# Altium schematic sheet CO2_Metar_SCH_0.SchDoc
size A; DocumentNumber: 1; SheetNumber: 1; SheetTotal: 2
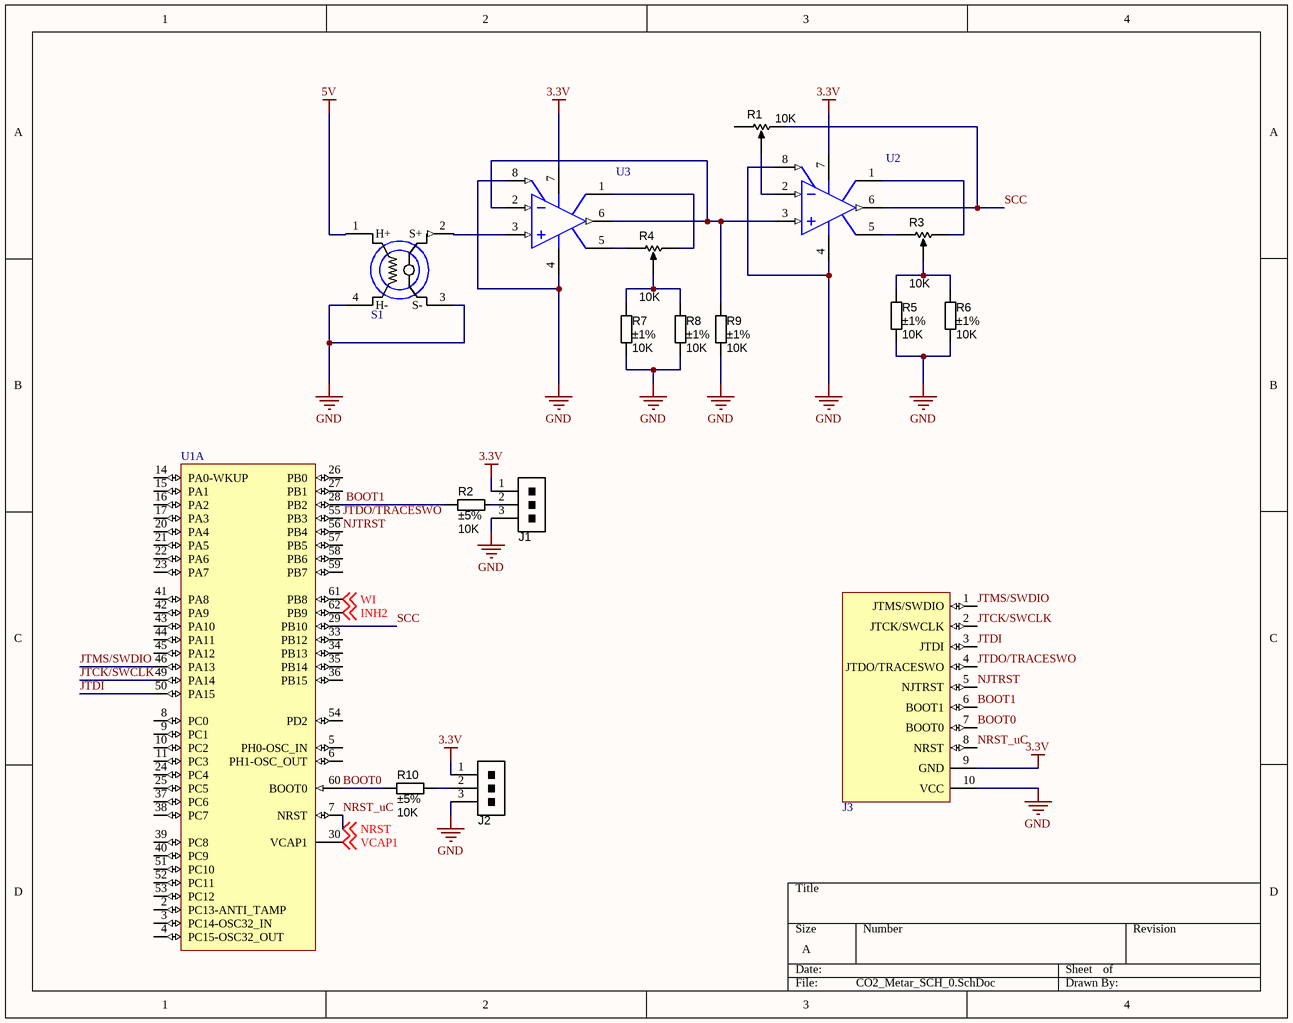
[diagram p0: CO2_Metar_SCH_0.SchDoc]

## Parts
J1  *  [1x3POS_HEADER]  (value not drawn)
J2  *  [1x3POS_HEADER]  (value not drawn)
J3  *  [SWJ-DP connector]  (value not drawn)
R1  value 10K  [TrimPot_SMD_Bourns_3214G]  (hidden comment: 5 Turn)
R2  value 10K  Tolerance: ±5%  [RESC1608X55N]  (hidden comment: Thick Film)
R3  value 10K  [TrimPot_SMD_Bourns_3214G]  (hidden comment: 5 Turn)
R4  value 10K  [TrimPot_SMD_Bourns_3214G]  (hidden comment: 5 Turn)
R5  value 10K  Tolerance: ±1%  [RESC1608X55N]  (hidden comment: Thick Film)
R6  value 10K  Tolerance: ±1%  [RESC1608X55N]  (hidden comment: Thick Film)
R7  value 10K  Tolerance: ±1%  [RESC1608X55N]  (hidden comment: Thick Film)
R8  value 10K  Tolerance: ±1%  [RESC1608X55N]  (hidden comment: Thick Film)
R9  value 10K  Tolerance: ±1%  [RESC1608X55N]  (hidden comment: Thick Film)
R10  value 10K  Tolerance: ±5%  [RESC1608X55N]  (hidden comment: Thick Film)
S1  *  [CO2_SENSOR]  (value not drawn)
U1  (no value)  [STM-LQFP64_N]  (part A of 2)
U2  (no value)  [D008_L]
U3  (no value)  [D008_L]

## Nets
3.3V: J1.1 J2.1 J3.9(GND) U2.7(V+) U3.7(V+)
5V: S1.1(H+)
GND: J1.3 J2.3 J3.10(VCC) R5.2 R6.2 R7.2 R8.2 R9.2 S1.3(S-) S1.4(H-) U2.4(V-) U2.8(BSEL) U3.4(V-) U3.8(BSEL)
BOOT0: J3.7(BOOT0) R10.2 U1.60(BOOT0)
BOOT1: J3.6(BOOT1) R2.2 U1.28(PB2)
INH2: U1.62(PB9) ; off-sheet INH2
JTCK/SWCLK: J3.2(JTCK/SWCLK) U1.49(PA14)
JTDI: J3.3(JTDI) U1.50(PA15)
JTDO/TRACESWO: J3.4(JTDO/TRACESWO) U1.55(PB3)
JTMS/SWDIO: J3.1(JTMS/SWDIO) U1.46(PA13)
NJTRST: J3.5(NJTRST) U1.56(PB4)
NRST_uC: J3.8(NRST) U1.7(NRST) ; off-sheet NRST  [also labelled NRST]
SCC: R1.3(CW) U1.29(PB10) U2.6(OUT)
VCAP1: U1.30(VCAP1) ; off-sheet VCAP1
WI: U1.61(PB8) ; off-sheet WI
NetJ1_2: J1.2 R2.1
NetJ2_2: J2.2 R10.1
NetR1_2: R1.2(WIPER) U2.2(IN-)
NetR3_1: R3.1(CCW) U2.5(OS_N2)
NetR3_2: R3.2(WIPER) R5.1 R6.1
NetR3_3: R3.3(CW) U2.1(OS_N1)
NetR4_1: R4.1(CCW) U3.5(OS_N2)
NetR4_2: R4.2(WIPER) R7.1 R8.1
NetR4_3: R4.3(CW) U3.1(OS_N1)
NetR9_1: R9.1 U2.3(IN+) U3.2(IN-) U3.6(OUT)
NetS1_2: S1.2(S+) U3.3(IN+)

Not connected (* = marked no-connect by the designer): R1 1(CCW); U1 2(PC13-ANTI_TAMP) 3(PC14-OSC32_IN) 4(PC15-OSC32_OUT) 5(PH0-OSC_IN) 6(PH1-OSC_OUT) 8(PC0) 9(PC1) 10(PC2) 11(PC3) 14(PA0-WKUP) 15(PA1) 16(PA2) 17(PA3) 20(PA4) 21(PA5) 22(PA6) 23(PA7) 24(PC4) 25(PC5) 26(PB0) 27(PB1) 33(PB12) 34(PB13) 35(PB14) 36(PB15) 37(PC6) 38(PC7) 39(PC8) 40(PC9) 41(PA8) 42(PA9) 43(PA10) 44(PA11) 45(PA12) 51(PC10) 52(PC11) 53(PC12) 54(PD2) 57(PB5) 58(PB6) 59(PB7)

## Library data of the parts
J1 J2 = CONN_HEADER_1x3P_0.100in: Pin Header, THT, Single-row, 2.54mm pitch; Manufacturer 1: 3M; Manufacturer Part Number 1: 929647-09-36-I; Pitch: 0.100" (2.54mm); Value: Single-row, 3 positions; QtyOverride: 0.1; SCDType: undef; Category: Connectors; Mounting Type: Through Hole; Terminal Block Type: Header, Male Pins, Single; Package / Case: Pin header; 2.54mm pitch; Supplier 1: Digi-Key; Supplier Part Number 1: 929647-09-36-ND
J3 = SWJ-Debug Port: 10 pin Serial Wire JTAG Debug Port
R1 R3 R4 = RES_TRIMMER_10K_5T_SMD: Trimmer SMD 10K 250mW 5-turn Side-adjust; Manufacturer 1: Bourns Inc.; Manufacturer Part Number 1: 3214G-1-103E; Tolerance: 10%; Ratings: 5 turn variable cermet; Number of Turns: 5; SCDType: spec; Supplier 1: Digi-Key; Supplier Part Number 1: 3214G-1-103ECT-ND
R2 R10 = RES_10K_0603_5%: Resistor SMD chip 10k Ohm 0.1W 5% 0603; Manufacturer 1: Yageo; Manufacturer Part Number 1: RC0603JR-0710KL; Ratings: 1/10 W; SCDType: spec; Package / Case: 0603 (1608 metric); Material: Thick Film; Supplier 1: Digi-Key; Supplier Part Number 1: 311-10KGRCT-ND; Supplier 2: Digi-Key; Supplier Part Number 2: 541-10KGCT-ND; Manufacturer 2: Vishay Dale; Manufacturer Part Number 2: CRCW060310K0JNEA; ComponentLink2URL: http://www.vishay.com/doc?20035; ComponentLink2Description: http://www.vishay.com/doc?20035; ComponentLink1URL: http://www.yageo.com/documents/recent/PYu-RC0603_51_RoHS_L_4.pdf; ComponentLink1Description: http://www.yageo.com/documents/recent/PYu-RC0603_51_RoHS_L_4.pdf
R5-R9 = RES_10K_0603_1%: Resistor SMD chip 10k Ohm 0.1W 1% 0603; Manufacturer 1: Yageo; Manufacturer Part Number 1: RC0603FR-0710KL; Ratings: 1/10W; SCDType: spec; Package / Case: 0603 (1608 Metric); Supplier 1: Digi-Key; Supplier Part Number 1: 311-10.0KHRCT-ND
S1 = TGS4161: Solid electrolyte type Carbon Dioxide sensor
U1 = STM32F401RBT6: ARM Cortex-M4 32-bit MCU+FPU, 105 DMIPS, 128 kB Flash, 64 kB Internal RAM, 48 I/Os, 64-pin LQFP, -40 to 85 degC, Tray; Manufacturer: STMicroelectronics; FLASH Size (Prog) (kB): 128; I/Os (High Current): 48; Internal RAM Size (kB): 64; Operating Frequency(F) (Processor speed) (MHz): 84; Supply Voltage(Vcc) max (V): 3.6; Supply Voltage(Vcc) min (V): 1.8; DatasheetVersion: Rev. 1; PackageVersion: Rev. 4, 06/2013; PackageReference: LQFP64; PackageDescription: 64-Pin Low Profile Quad Flat Package, 10 x 10 mm Body, 0.5 mm Pitch; Supplier 1: Newark; Supplier Part Number 1: 19X6220; Supplier 2: Mouser; Supplier Part Number 2: 511-STM32F401RBT6; Core: ARM Cortex-M4; Packing: Tray; Mounting Technology: Surface Mount; PartNumber: STM32F401RBT6; ComponentLink1Description: Manufacturer URL; ComponentLink1URL: http://www.st.com/web/en/home.html; ComponentLink2Description: Datasheet; ComponentLink2URL: http://www.st.com/st-web-ui/static/active/en/resource/technical/document/data_brief/DM00071938.pdf; ComponentLink3Description: Package Specification; ComponentLink3URL: http://www.st.com/st-web-ui/static/active/en/resource/technical/document/datasheet/DM00037051.pdf
U2 U3 = TLC271AID: LinCMOS Programmable Low-Power Operational Amplifier; Published: 15-Apr-2002; LatestRevisionDate: 13-Apr-2006; LatestRevisionNote: IPC-7351 Footprint Added.; DatasheetVersion: Mar-1989; PackageVersion: Jan-1998; PackageReference: D008; Publisher: Altium Limited; PackageDescription: 8-Pin Small Outline Integrated Circuit 1.27 mm Pitch; Code_IPC: SOIC127P600-8; ComponentLink1Description: Manufacturer Link; ComponentLink1URL: http://www.ti.com/; ComponentLink2Description: Datasheet; ComponentLink2URL: http://www-s.ti.com/sc/ds/tlc271.pdf